# Altium schematic sheet ne555 timer.SchDoc
size A4
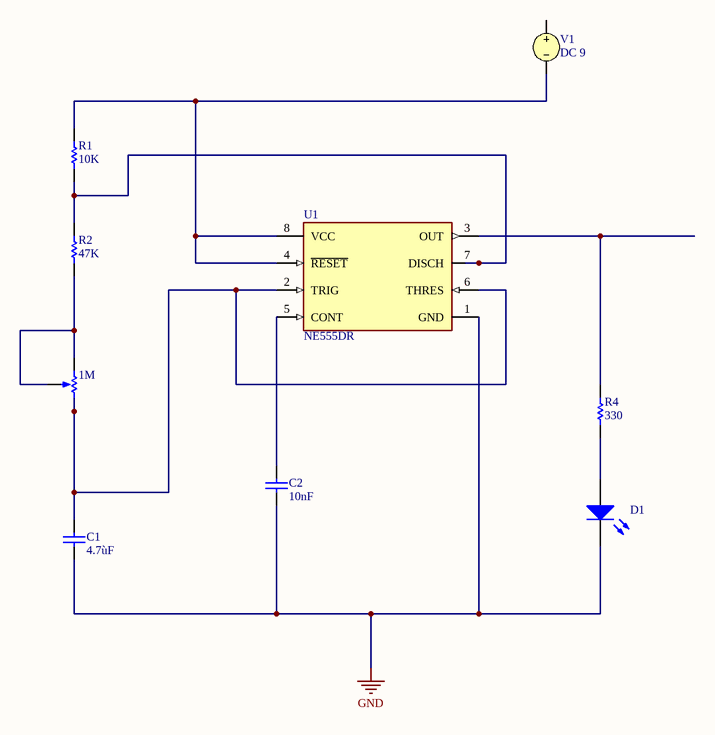
[diagram p0: ne555 timer.SchDoc]

## Parts
1M  Potentiometer  (value not drawn)
C1  value 4.7ùF  (hidden comment: Capacitor)
C2  value 10nF  (hidden comment: Capacitor)
D1  Light-Emitting Diode  (value not drawn)
R1  value 10K  (hidden comment: Resistor)
R2  value 47K  (hidden comment: Resistor)
R4  value 330  (hidden comment: Resistor)
U1  NE555DR  [FP-D0008A-IPC_A]
V1  DC 9

## Nets
GND: C1.1 C2.1 D1.2(K) U1.1(GND)
Net1M_1: 1M.1(TOP) 1M.3(TAP) R2.1
Net1M_2: 1M.2(BOT) C1.2 U1.2(TRIG) U1.6(THRES)
NetC2_2: C2.2 U1.5(CONT)
NetD1_1: D1.1(A) R4.1
NetR1_1: R1.1 R2.2 U1.7(DISCH)
NetR1_2: R1.2 U1.4(~{RESET}) U1.8(VCC) V1.2
NetR4_2: R4.2 U1.3(OUT)

Not connected (* = marked no-connect by the designer): V1 1

## Library data of the parts
1M = Potentiometer: value: 1k; position: 0.5; SimulationGenericComponent: True
C1 C2 = Capacitor: SimulationGenericComponent: True
D1 = LED: AF: 1; BV: 0; BV_MAX: 1e99; EG: 1.11; FC: 0.5; IBV: 0.001; IS: 1e-14; MJSW: 0.33; NTUN: 30; TNOM: 27; XTI: 3; SimulationGenericComponent: True; CJO: 0; CJP: 0; CTA: 0; CTP: 0; FCS: 0.5; FV_MAX: 1e99; IKF: 0; IKR: 0; ISR: 1e-14; JSW: 0; JTUN: 0; JTUNSW: 0; KEG: 1; KF: 0; LEVEL: 1; N: 1; NBV: 1; NR: 1; NS: 1; PHP: 1; RS: 0; TCV: 0; TLEV: 0; TLEVC: 0; TM1: 0; TM2: 0; TPB: 0; TPHP: 0; TRS: 0; TRS2: 0; TT: 0; TTT1: 0; TTT2: 0; VJ: 1; XTITUN: 3
R1 R2 R4 = Resistor: TC1: 0; SimulationGenericComponent: True; TC2: 0
U1 = CMP-1685-00007-2: IC OSC SGL TIMER 100KHZ 8-SOIC; Low Level Output Current: 200mA; Quiescent Current: 15mA; Min Supply Voltage: 4.5V; Number of Timers/Counters: 1; Max Supply Voltage: 16V; Operating Supply Current: 10mA; High Level Output Current: -200mA; Packaging: Tape and Reel; Frequency: 100kHz; Weight: 0.002561oz; REACH SVHC: No SVHC; Package Quantity: 2500; Width: 3.91mm; Max Operating Temperature: 70°C; Contact Plating: Gold; Lead Free: Lead Free; Number of Pins: 8; Min Operating Temperature: 0°C; Radiation Hardening: No; Length: 4.9mm; Case/Package: SOIC; Height: 1.58mm; Mount: Surface Mount
V1 = VSRC: Voltage Source; Note: PCB Footprint - Not required; AC Magnitude: 1; AC Phase: 0; Value: 9; Published: 8-Jun-2000; LatestRevisionDate: 17-Jul-2002; LatestRevisionNote: Re-released for DXP Platform.; PackageReference: Not Applicable; Publisher: Altium Limited